# EAGLE schematic Motor (EAGLE 6.4)
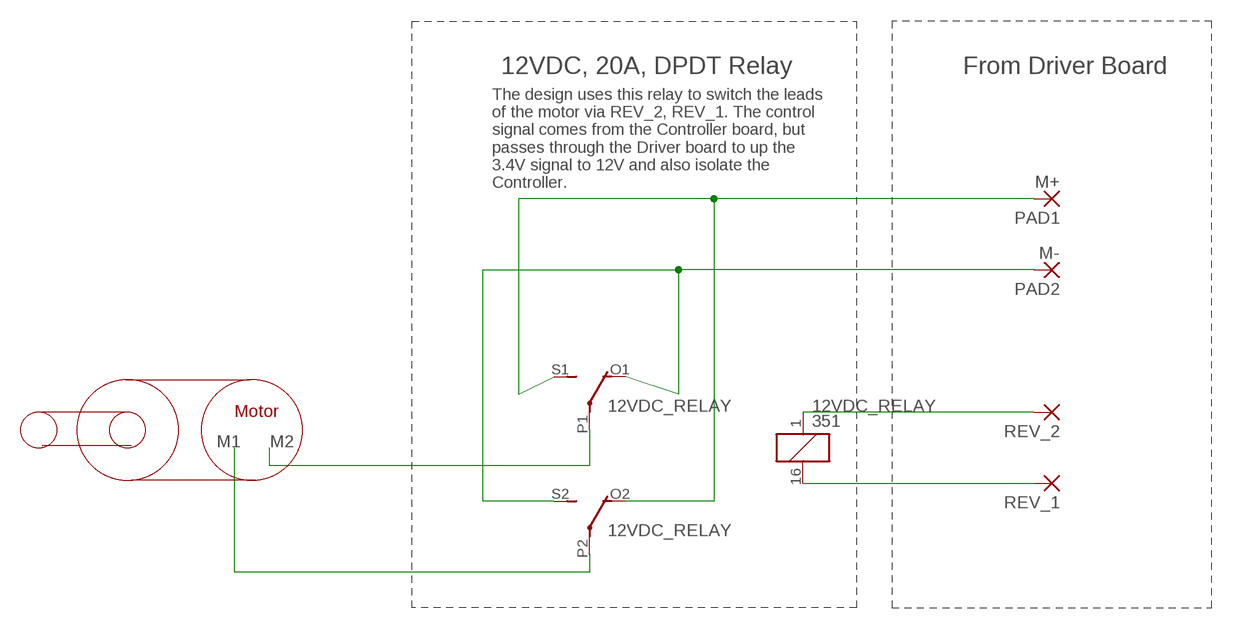
[diagram p0: schematic, sheet 1]

## Parts
12VDC_RELAY  351  [351]
PAD1  M+  2,54/0,9  [2,54/0,9]
PAD2  M-  2,54/0,9  [2,54/0,9]
REV_1  2,54/0,9  [2,54/0,9]
REV_2  2,54/0,9  [2,54/0,9]

## Nets
M1: 12VDC_RELAY.P2(3:P)
M2: 12VDC_RELAY.P1(2:P)
N$1: 12VDC_RELAY.O2(3:O) 12VDC_RELAY.S1(2:S) PAD1.1(P)
N$2: 12VDC_RELAY.1 REV_2.1(P)
N$3: 12VDC_RELAY.O1(2:O) 12VDC_RELAY.S2(3:S) PAD2.1(P)
N$4: 12VDC_RELAY.16 REV_1.1(P)

## Notes on the sheet
- 12VDC, 20A, DPDT Relay | From Driver Board
- The design uses this relay to switch the leads
  of the motor via REV_2, REV_1. The control
  signal comes from the Controller board, but 
  passes through the Driver board to up the
  3.4V signal to 12V and also isolate the
  Controller.
- Motor

## Library data of the parts
12VDC_RELAY = relay:351: RELAY 2 x switch, Omron; OC_FARNELL: unknown; OC_NEWARK: unknown
PAD1 PAD2 REV_1 REV_2 = wirepad:2,54/0,9: THROUGH-HOLE PAD